# EAGLE design Adafruit PowerBoost Shield (EAGLE 6.6.0)
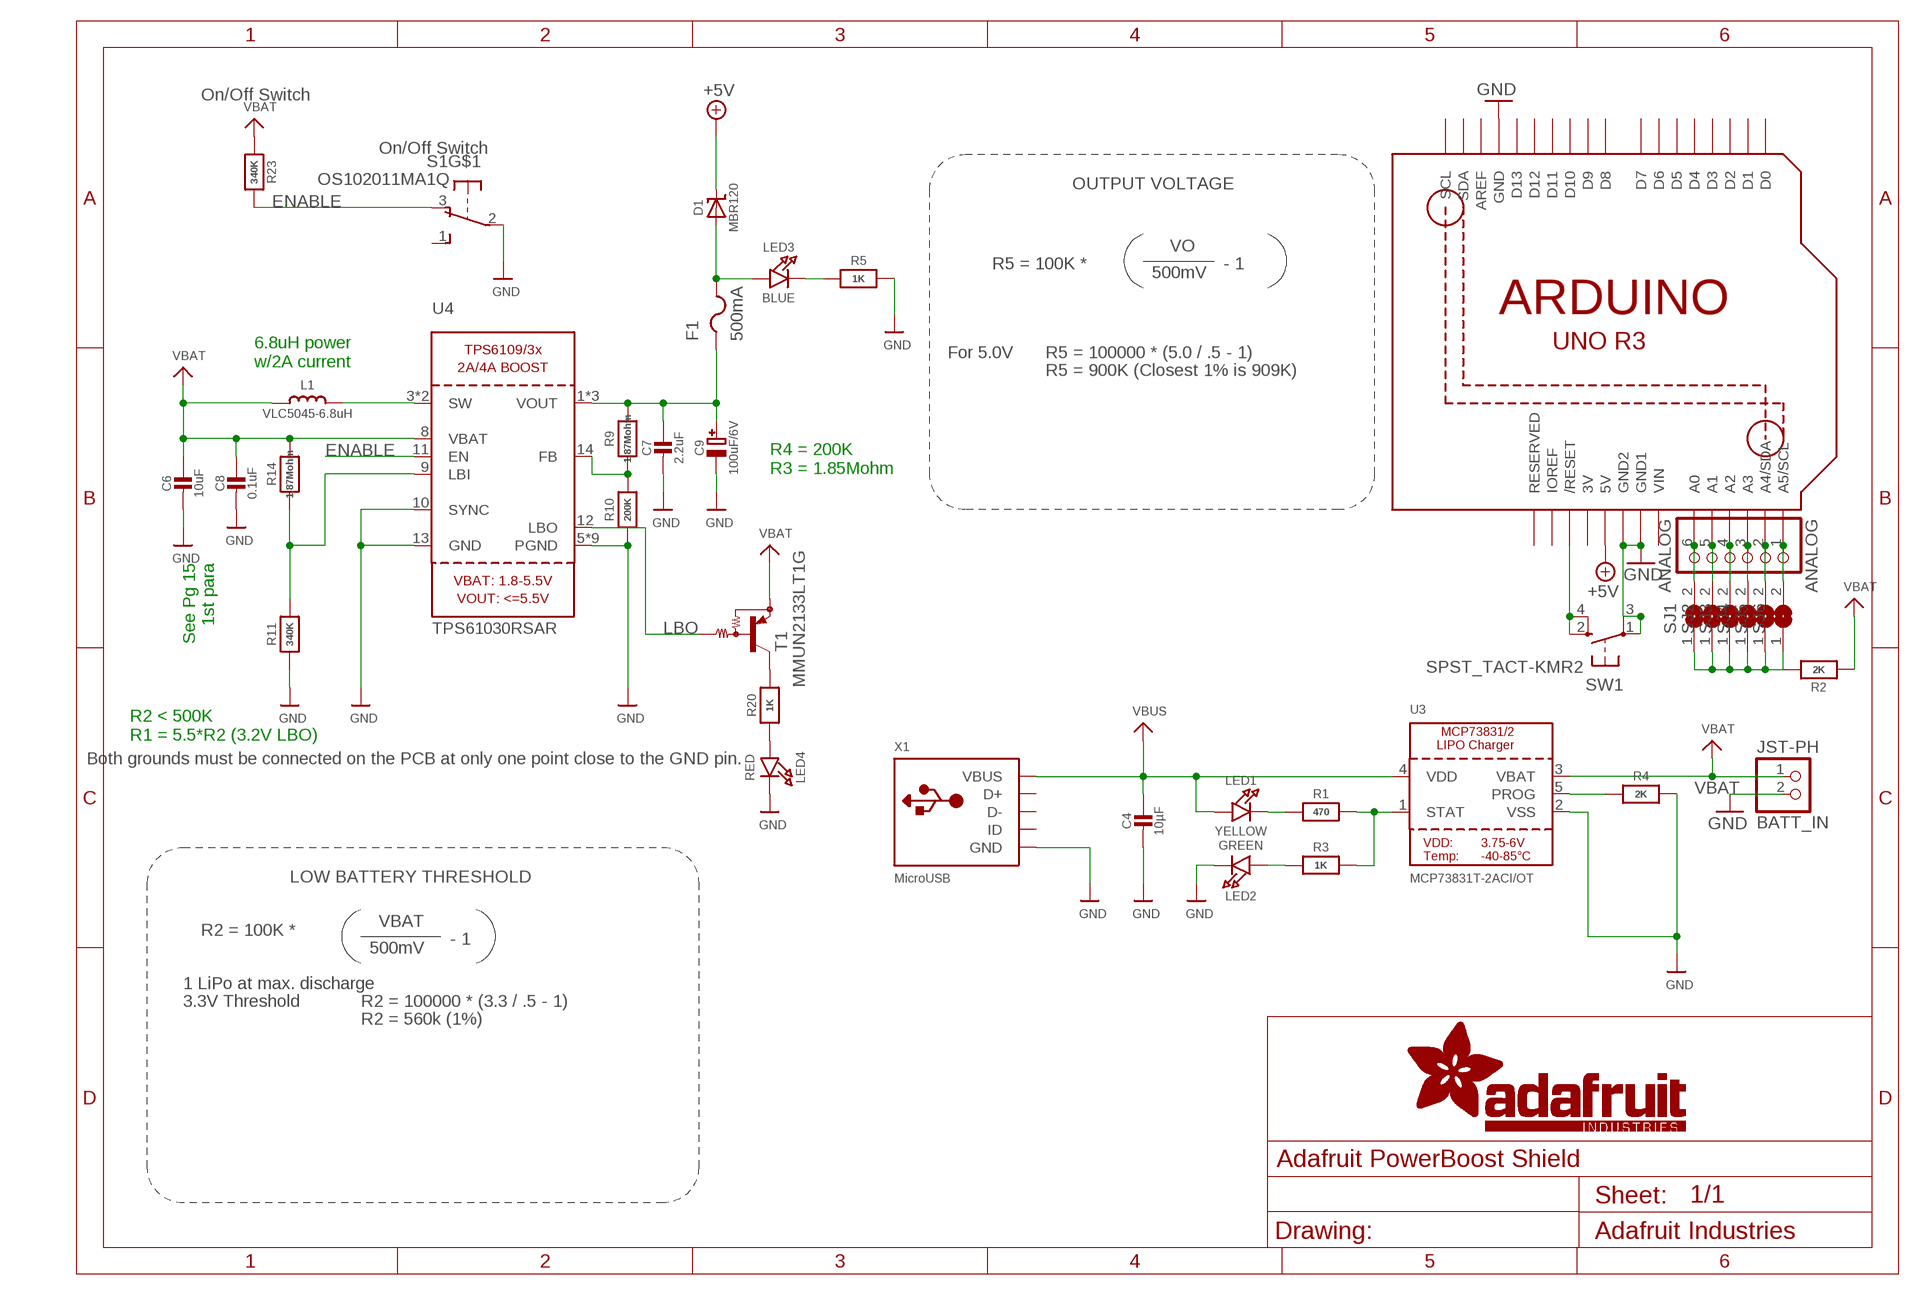
[diagram p0: schematic, sheet 1]

## Parts
ANALOG  ANALOG  PINHD-1X6  [1X06]
BATT_IN  JST-PH  JST_2PIN-SMT  [JST-PH-2-SMT]
C4  10µF  CAP_CERAMIC0805-NOOUTLINE  [0805-NO]
C6  10uF  CAP_CERAMIC0805-NOOUTLINE  [0805-NO]
C7  2.2uF  CAP_CERAMIC0805-NOOUTLINE  [0805-NO]
C8  0.1uF  CAP_CERAMIC0805-NOOUTLINE  [0805-NO]
C9  100uF/6V  CAP_TANTALUMB/3528_REFLOW  [EIA3528-21/B-R]
D1  MBR120  DIODE-SCHOTTKYSOD-123  [SOD-123]
F1  500mA  PTCFUSE-1206  [R1206]
L1  VLC5045-6.8uH  INDUCTORTDK_VLC5045  [INDUCTOR_5X5MM_TDK_VLC5045]
LED1  YELLOW  LED0805_NOOUTLINE  [CHIPLED_0805_NOOUTLINE]
LED2  GREEN  LED0805_NOOUTLINE  [CHIPLED_0805_NOOUTLINE]
LED3  BLUE  LED0805_NOOUTLINE  [CHIPLED_0805_NOOUTLINE]
LED4  RED  LED0805_NOOUTLINE  [CHIPLED_0805_NOOUTLINE]
R1  470  RESISTOR0805_NOOUTLINE  [0805-NO]
R2  2K  RESISTOR0805_NOOUTLINE  [0805-NO]
R3  1K  RESISTOR0805_NOOUTLINE  [0805-NO]
R4  2K  RESISTOR0805_NOOUTLINE  [0805-NO]
R5  1K  RESISTOR0805_NOOUTLINE  [0805-NO]
R9  1.87Mohm  RESISTOR0805_NOOUTLINE  [0805-NO]
R10  200K  RESISTOR0805_NOOUTLINE  [0805-NO]
R11  340K  RESISTOR0805_NOOUTLINE  [0805-NO]
R14  1.87Mohm  RESISTOR0805_NOOUTLINE  [0805-NO]
R20  1K  RESISTOR0805_NOOUTLINE  [0805-NO]
R23  340K  RESISTOR0805_NOOUTLINE  [0805-NO]
S1  OS102011MA1Q  [OS102011MA1Q]
SJ1  SOLDERJUMPER  [SOLDERJUMPER_ARROW_NOPASTE]
SJ2  SOLDERJUMPER  [SOLDERJUMPER_ARROW_NOPASTE]
SJ3  SOLDERJUMPER  [SOLDERJUMPER_ARROW_NOPASTE]
SJ4  SOLDERJUMPER  [SOLDERJUMPER_ARROW_NOPASTE]
SJ5  SOLDERJUMPER  [SOLDERJUMPER_ARROW_NOPASTE]
SJ6  SOLDERJUMPER  [SOLDERJUMPER_ARROW_NOPASTE]
SW1  SPST_TACT-KMR2  [KMR2]
T1  MMUN2133LT1G  MUN2114T1-PNP_DRIVER-SC59-BEC  [SC59-BEC]
U2  ARDUINOR3-NOSILK  [ARDUINOR3-NOSILK]
U3  MCP73831T-2ACI/OT  MCP73831/2  [SOT23-5]
U4  TPS61030RSAR  VREG_TPS6103X  [PVQFN-16]
U$3  FIDUCIAL  [FIDUCIAL_1MM]
U$4  FIDUCIAL  [FIDUCIAL_1MM]
X1  MicroUSB  USBMICRO_20329  [4UCONN_20329]

## Nets
+5V: D1.C U2.5V
A0: ANALOG.6 SJ1.2 U2.A0
A1: ANALOG.5 SJ2.2 U2.A1
A2: ANALOG.4 SJ3.2 U2.A2
A3: ANALOG.3 SJ4.2 U2.A3
A4: ANALOG.2 SJ5.2 U2.A4(A4/SDA)
A5: ANALOG.1 SJ6.2 U2.A5(A5/SCL)
ENABLE: R23.2 S1.3(O) U4.11(EN)
FB: R9.1 R10.2 U4.14(FB)
GND: BATT_IN.2 C4.2 C6.2 C7.2 C8.2 C9.- LED2.C LED4.C R4.2 R5.2 R10.1 R11.1 S1.2(P) SW1.1(P) SW1.3(P1) U2.GND U2.GND1 U2.GND2 U3.2(VSS) U4.5(PGND) U4.6(PGND) U4.7(PGND) U4.10(SYNC) U4.13(GND) U4.P$18(PGND) U4.P$19(PGND) U4.P$20(PGND) U4.P$21(PGND) U4.P$22(PGND) U4.THERMAL(PGND) X1.BASE@1(GND) X1.BASE@2(GND) X1.GND X1.SPRT@1(GND) X1.SPRT@2(GND) X1.SPRT@3(GND) X1.SPRT@4(GND)
LBI: R11.2 R14.1 U4.9(LBI)
LBO: T1.B U4.12(LBO)
N$1: R2.2 SJ1.1 SJ2.1 SJ3.1 SJ4.1 SJ5.1 SJ6.1
N$2: LED1.C R1.1
N$3: R1.2 R3.2 U3.1(STAT)
N$4: L1.P$2 U4.3(SW) U4.4(SW)
N$5: R4.1 U3.5(PROG)
N$6: LED2.A R3.1
N$9: LED3.C R5.1
N$15: LED4.A R20.1
N$16: R20.2 T1.C
N$19: D1.A F1.2 LED3.A
RESET: SW1.2(S) SW1.4(S1) U2.RESET(/RESET)
VBAT: BATT_IN.1 C6.1 C8.1 L1.P$1 R2.1 R14.2 R23.1 T1.E U3.3(VBAT) U4.8(VBAT)
VBUS: C4.1 LED1.A U3.4(VDD) X1.VBUS
VOUT: C7.1 C9.+ F1.1 R9.2 U4.1(VOUT) U4.15(VOUT) U4.16(VOUT)
Unconnected: S1.1(S) S1.MT1(MT) S1.MT2(MT) U2.AREF U2.D0 U2.D1 U2.D2 U2.D3 U2.D4 U2.D5 U2.D6 U2.D7 U2.D8 U2.D9 U2.D10 U2.D11 U2.D12 U2.D13 U2.IOREF U2.RESERVED U2.SCL U2.SDA X1.D+ X1.D- X1.ID

## Notes on the sheet
- On/Off Switch
- On/Off Switch
- OUTPUT VOLTAGE
- VO
- R5 = 100K * | - 1
- 500mV
- For 5.0V | R5 = 100000 * (5.0 / .5 - 1)
- 6.8uH power
  w/2A current
- R5 = 900K (Closest 1% is 909K)
- R4 = 200K
  R3 = 1.85Mohm
- See Pg 15
  1st para
- R2 < 500K
  R1 = 5.5*R2 (3.2V LBO)
- Both grounds must be connected on the PCB at only one point close to the GND pin.
- LOW BATTERY THRESHOLD
- VBAT
- R2 = 100K *
- - 1
- 500mV
- 1 LiPo at max. discharge
- 3.3V Threshold | R2 = 100000 * (3.3 / .5 - 1)
- R2 = 560k (1%)

## Power pins joined to a net without a drawn wire
3V: U2.3V
VIN: U2.VIN

## Library data of the parts
ANALOG = adafruit:PINHD-1X6: PIN HEADER
BATT_IN = adafruit:JST_2PIN: JST 2-Pin Connectors of various flavors SMT-RA (S2B-PH-SM4) 4UConnector #17311 SMT (B2B-PH-SM4) THM-RA (S2B-PH) THM (B2B-PH)
C4 C6-C8 = microbuilder:CAP_CERAMIC: Ceramic Capacitors For new designs, use the packages preceded by an '_' character since they are more reliable: The following footprints should be used on most boards: _0402 - Standard footprint for regular board layouts _0603 - Standard footprint for regular board layouts _0805 - Standard footprint for regular board layouts _1206 - Standard footprint for regular board layouts For extremely tight-pitch boards where space is at a premium, the following 'micro-pitch' footprints can be used (smaller pads, no silkscreen outline, etc.): _0402MP - Micro-pitch footprint for very dense/compact boards _0603MP - Micro-pitch footprint for very dense/compact boards _0805MP - Micro-pitch footprint for very dense/compact boards _1206MP - Micro-pitch footprint for very dense/compact boards
C9 = microbuilder:CAP_TANTALUM: Tantalum Capacitors Wave footprints have larger pads and are meant to be used for hand soldering. Reflow footprints are optimised for solder paste and a reflow oven. EIA3216-18/A-[R/W] - Size A / 3216-18 / 1206 footprint 4.7µF 25V 10% Tantalum Capacitor 10µF 16V 10% Tantalum Capacitor [Digikey: 495-2236-2-ND] EIA3528-21/B-[R/W] - Size B / 3528-21 47µF 10V 10% Tantalum Capactior [Digikey: 495-2216-1-ND] EIA6032-28/C-[R/W] - Size C / 6032-28 10µF 35V 20% Tantalum Capacitor [Digikey: 495-2285-1-ND] 100µF 16V 10% Tantalum Capactior [Digikey: 399-5214-1-ND]
D1 = microbuilder:DIODE-SCHOTTKY
F1 = adafruit:PTCFUSE: PTC fuses, resettable thermistors
L1 = microbuilder:INDUCTOR: Inductors 0603: 10nH Ceramic Inductor - microwire antenna/RF (Digikey: 712-1434-2-ND) 0805: 560nH Ceramic Inductor - RF (Digikey: 553-1047-1-ND) 270nH Ceramic Inductor - Q = 40@250MHz, +-5%, 1 Ohm DC Resistance (Digikey: 535-10506-2-ND) 1007 (2518 Metric) SMT: 10µH 10% 250mOhm 820mA 1007 Inductor (Digikey: 587-2189-1-ND) 22µH 10% 500mOhm 580mA 1007 Inductor (Digikey: 587-2190-1-ND) 47µH 10% 950mOhm 420mA 1007 Inductor (Digikey: 587-2191-1-ND) 47µH 5% 100mOhm 1A 1008 Inductor (Digikey: 732-1816-1-ND) 5.0x5.0mm (Taiyo Yuden NR5040 Series) 6.8µH 20% 2.3A 64mOhm Inductor (Digikey: 587-2374-2-ND) 5.0x5.0mm (TDK VLC5045 Series) 4.7µH 20% 3.3A 34mOhm Inductor (Digikey: 445-6526-1-ND) 6.8µH 20% 2.7A 46mOhm Inductor (Digikey: 445-6527-1-ND) 6.0x6.0mm (TDK VLC6045 Series) 4.7µH 20% 3.8A 27mOhm Inductor (Digikey: 445-6538-2-ND) 6.8µH 20% 3A 41mOhm Inductor (Digikey: 445-6540-1-ND) 6.2µH 30% 2.2A 45mOhm Inductor (Digikey: SRR5028-6R2YCT-ND) - Not TDK VLC6045 but footprint should match 6.0x6.0mm (TDK SLF6045 Series) 6.8uH 30% 2A 33mOhm Inductor (Digikey: 445-4572-1-ND, Mouser: 810-SLF645T6R8N2R0PF) 6.0x6.0mm (Sumida CDRH5D28 Series) 6.2uH 30% 1.8A 45mOhm Inductor (Digikey: 308-1542-1-ND) Taiyo Yuden NR3015T2R2M - 2.2uH 20% 1.5A (Digikey: 587-1648-2-ND, Mouser: 963-NR3015T2R2M) - Used with TI TPS62172 CoilCraft RFID Transponder Coil - MA5532-AE (For use with AS3935 Lightning Sensor) Vishay IHLP 1.0uH Molded Inductor - 24mOhm DCR, 5A, +/-20%, -55°C-125°C (Digikey: 541-1319-1-ND)
LED1-LED4 = microbuilder:LED: LED 0603 - 0603 Surface Mount Package 2mA: Green LED - Low Power (3.9mcd, 2ma, 1.7Vf) - Digikey: 475-2709-2-ND Orange LED - Low Power (9.8mcd, 2ma, 1.8Vf) - Digikey: 475-1194-2-ND Red LED - Low Power (5mcd, 2ma, 1.8Vf) - Digikey: 475-1195-2-ND Yellow LED - Low Power (7mcd, 2ma, 1.8Vf) - Digikey: 475-1196-2-ND 5mA: Blue LED - Low Power (17mcd, 5ma, 2.9Vf) - Digikey: LNJ937W8CRACT-ND 0805 - 0805 Surface Mount Package 2mA: Red LED (8.8mcd, 2mA, 1.8Vf, Clear) - Low Power [Digikey: 475-2510-1-ND] Green LED (5mcd, 2mA, 1.8Vf, Clear) - Low Power [Digikey: 475-2730-1-ND] Yellow LED (11.3mcd, 2mA, 1.8Vf, Clear) - Low Power [Digikey: 475-2555-1-ND] 20mA: Red LED (104mcd, 20mA, Diffused) - LS R976 [Digikey: 475-1278-6-ND] Red LED (12mcd, 20mA, 2.0Vf, Clear) - APT2012EC [Digikey: 754-1128-1-ND] Green LED (15mcd, 20mA, 2.2Vf, Clear) - APT2012GC [Digikey: 754-1131-1-ND] Orange LED (160mcd, 20mA, 2.1Vf, Clear) - APT2012SECK [Digikey: 754-1130-1-ND] 1206 - 1206 Surface Mount Package Green LED (26mcd, 20mA, Diffused) - LG N971 [Digikey: 475-1407-6-ND] Red LED (15mcd, 20mA, Diffused) - LH N974 [Digikey: 475-1416-6-ND] Cree - Cree High-Power Surface Mount LEDs XPEBWT-L1-0000-00D50 - White 111lm 350mA 2.9Vf 6200K 110° XTEAWT-00-0000-00000LEE3 - White 114lm 350mA 2.85Vf 5000K 115° Everlight - Everlight 45-21 Series Surface Mount LEDs 45-21/QK2C-B2832AC2CB2/2T - Warm White 2000mcd 20mA 3.25Vf 3050K 120° 45-21/LK2C-B38452C4CB2/2T - Nuetral White 2000mcd 20mA 3.25Vf 4150K 120° 45-21/LK2C-B50634C6CB2/2T - Cold White 2200mcd 20mA 3.25Vf 5650K 120° PLCC2 Reverse Mount LS T77K-J1L2-1-0-2-R18-Z - Red 11.25mcd 2mA 1.8Vf 630nm 120° LO T77K-L1M2-24-Z - Orange 19.6mcd 2mA 1.8Vf 606nm 120° LY T77K-K2M1-26-Z - Yellow 15.7mcd 2mA 1.8Vf 587nm 120°
R1-R5 R9-R11 R14 R20 R23 = microbuilder:RESISTOR: Resistors For new designs, use the packages preceded by an '_' character since they are more reliable: The following footprints should be used on most boards: _0402 - Standard footprint for regular board layouts _0603 - Standard footprint for regular board layouts _0805 - Standard footprint for regular board layouts _1206 - Standard footprint for regular board layouts For extremely tight-pitch boards where space is at a premium, the following 'micro-pitch' footprints can be used (smaller pads, no silkscreen outline, etc.): _0402MP - Micro-pitch footprint for very dense/compact boards _0603MP - Micro-pitch footprint for very dense/compact boards _0805MP - Micro-pitch footprint for very dense/compact boards _1206MP - Micro-pitch footprint for very dense/compact boards
S1 = adafruit:OS102011MA1Q: OS10201MA1Q through-hole right angle switch http://www.ladyada.net/library/eagle
SJ1-SJ6 = microbuilder:SOLDERJUMPER: SMD Solder JUMPER Solder the two pads together to create a connection, or remove the solder to break it. REFLOW - Use this footprint for solder paste and reflow ovens. WAVE - Use this footprint for hand-soldering (larger pads). CLOSED - Has a trace between the two pads to ensure it is closed by default. The trace needs to be cut to disable the jumper, and can be closed again by creating a solder bridge between the two pads.; BOM: EXCLUDE
SW1 = adafruit:SPST_TACT: SMT 6mm switch, EVQQ2 series http://www.ladyada.net/library/eagle
T1 = transistor:*-PNP_DRIVER-: PNP Bias Resistor Transistor
U2 = microbuilder:ARDUINOR3: This is a new object for the new Arduino R3 - with extra pins that you may want to use (such as IOref, and duplicated A4/A5
U3 = microbuilder:MCP73831/2: MCP73831/2 LIPO Charger VDD: 3.75 - 6V Temp -40 - 85°C Programmable Charge Rate: 15-500mA NOTE: STAT is a tri-state logic output on the MCP73831 and an open-drain output on the MCP73832. SOT23-5 with 4.2V output and tri-state logic on STAT = MCP73831T-2ACI/OT
U4 = microbuilder:VREG_TPS6103X: TPS6103x 4A Boost - 1.8-5.5V Input, Adjustable Output to 5.5V
U$3 U$4 = adafruit:FIDUCIAL: For use by pick and place machines to calibrate the vision/machine, 1mm By microbuilder.eu
X1 = microbuilder:USB: USB Connectors USBMINIB - Surface Mount Female Mini-B USB Connector 4UConnector: 06564

## Board
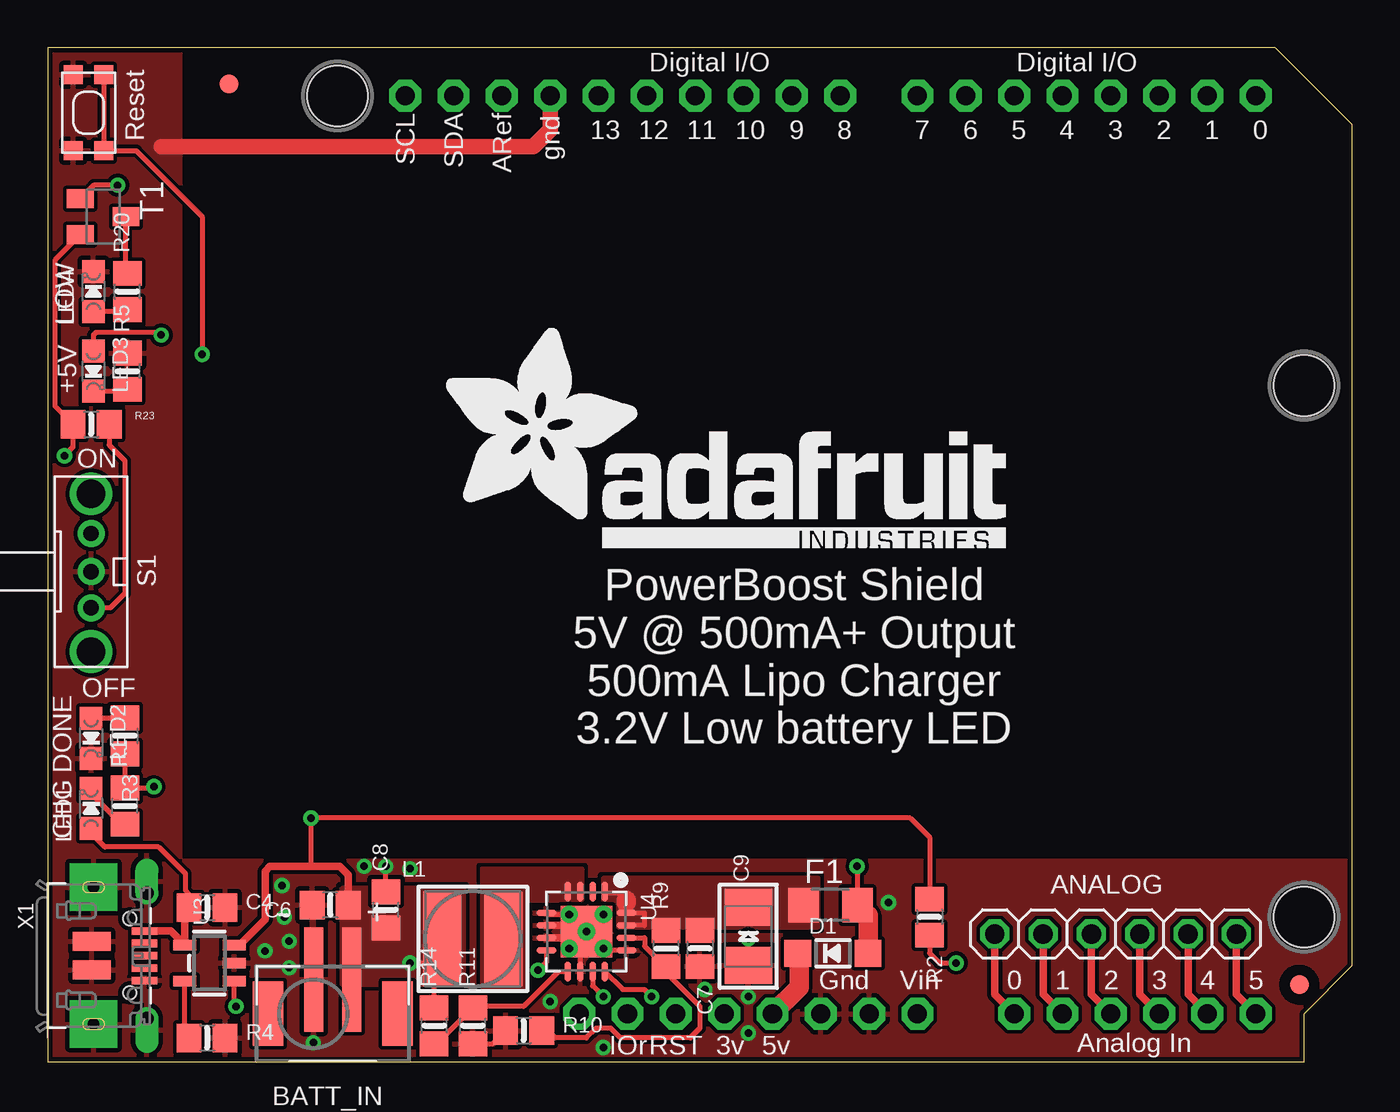
[diagram p1: board, top side]
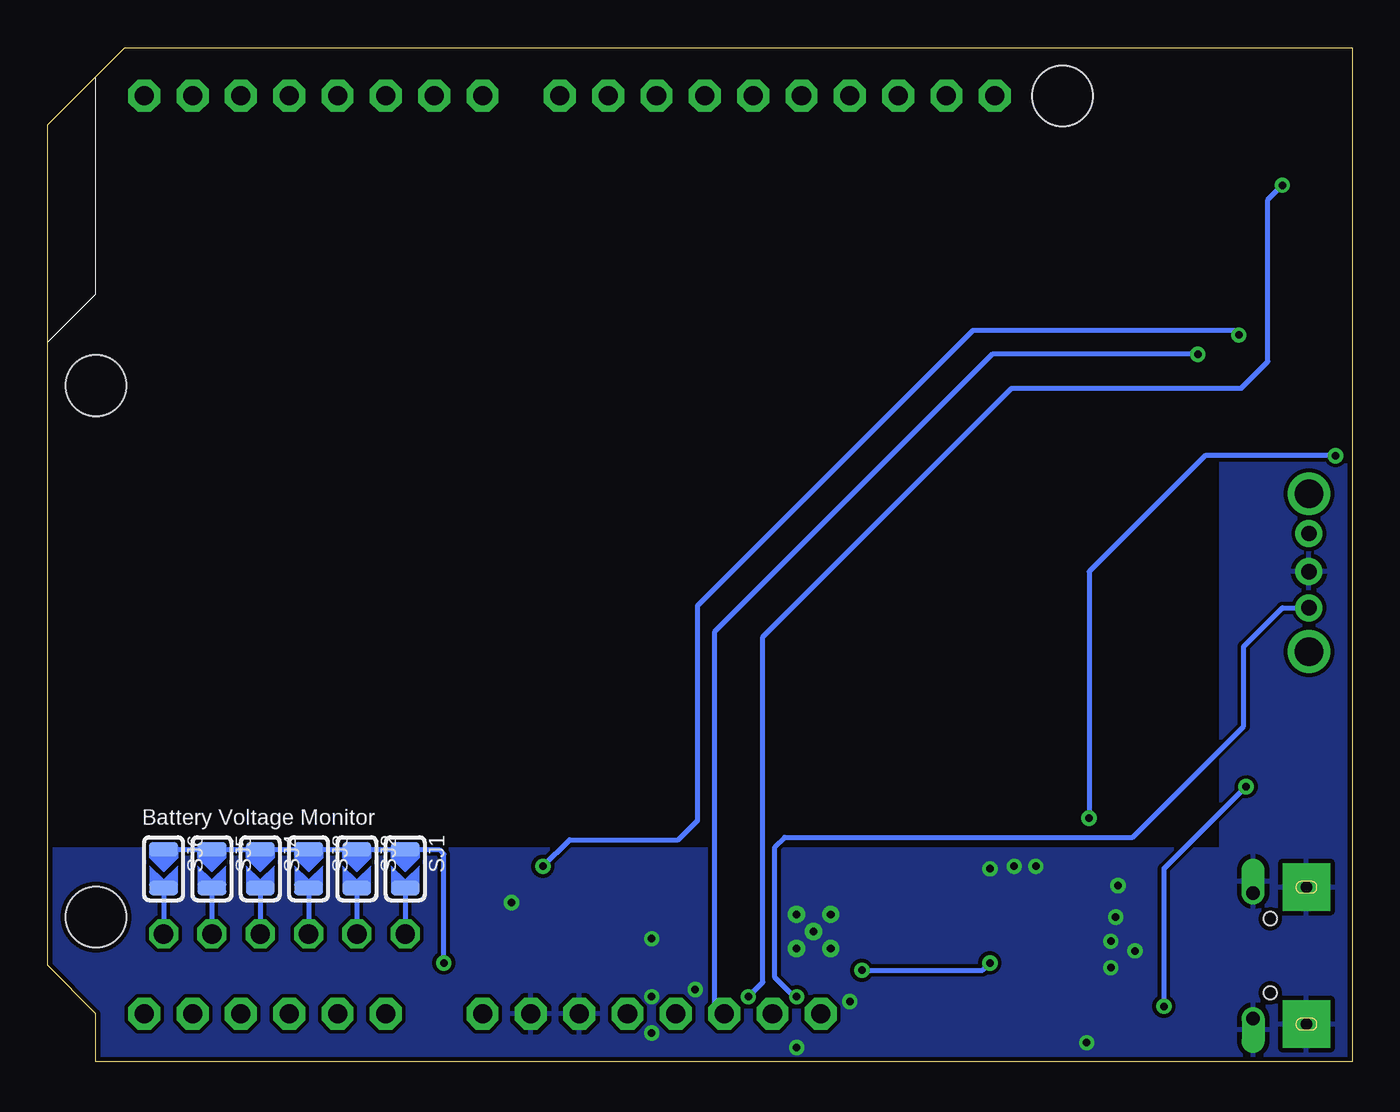
[diagram p2: board, bottom side, seen from below]

Size 68.58 x 53.34 mm. Coordinates in mm from the lower left corner, seen from the top.
Outline: 0,0 66.04,0 66.04,2.54 68.58,5.08 68.58,49.28 64.52,53.34 0,53.34 0,0
Copper layers (1*16): Top 0.035mm / dielectric 1.5mm / Bottom 0.035mm
Design rules "adafruit *": minimum track width 8mil, minimum drill 15.5mil, track to track 8mil, track to pad 8mil, pad to pad 8mil, via to via 8mil, smd to smd 8mil, copper to edge 10mil, drill to drill 8mil, minimum pad ring 10mil, minimum via ring 8mil, stop-mask expansion 2mil, vias tented up to drill 20mil, thermal gap 10mil
Holes 3.2 mm at 15.24,50.8 66.04,7.62 66.04,35.56
tRestrict: area 26,7.5 to 26.4,7.6; area 25.9,6.8 to 26.3,6.9

### Footprints (pad centres in the part's own frame; a part is rotated, then mirrored left to right if it is on the bottom)
1X06 = drill 1.016 octagon: 1 -6.35,0; 2 -3.81,0; 3 -1.27,0; 4 1.27,0; 5 3.81,0; 6 6.35,0
JST-PH-2-SMT = smd 1 x 5.5: 1 -1,-1.8; 2 1,-1.8 | smd 1.6 x 3.4: NC1 -3.4,0; NC2 3.4,0
0805-NO = smd 1.3 x 1.5: 1 -0.95,0; 2 0.95,0
EIA3528-21/B-R = smd 1.95 x 2.5: + 1.525,0; - -1.525,0
SOD-123 = smd 1.4 x 1.4: A 1.85,0; C -1.85,0
R1206 = smd 1.6 x 1.803: 1 -1.422,0; 2 1.422,0
INDUCTOR_5X5MM_TDK_VLC5045 = smd 2 x 5: P$1 -1.6,0; P$2 1.6,0
CHIPLED_0805_NOOUTLINE = smd 1.2 x 1.2: A 0,-1.05; C 0,1.05
OS102011MA1Q = drill 0.8 pad 1.422: 1 -2,0; 2 0,0; 3 1.9,0 | drill 1.5 pad 2.184: MT1 -4.1,0; MT2 4.2,0
SOLDERJUMPER_ARROW_NOPASTE = smd 0.762 x 1.524: 1 -1.016,0; 2 1.016,0
KMR2 = smd 1 x 1: 1 2,0.8; 2 2,-0.8; 3 -2,0.8; 4 -2,-0.8
SC59-BEC = smd 1 x 1.4: B -0.95,-1.2; C 0,1.2; E 0.95,-1.2
ARDUINOR3-NOSILK = drill 1 pad 1.676 octagon: 3V 35.56,2.54; 5V 38.1,2.54; A0 50.8,2.54; A1 53.34,2.54; A2 55.88,2.54; A3 58.42,2.54; A4 60.96,2.54; A5 63.5,2.54; AREF 23.876,50.8; D0 63.5,50.8; D1 60.96,50.8; D2 58.42,50.8; D3 55.88,50.8; D4 53.34,50.8; D5 50.8,50.8; D6 48.26,50.8; D7 45.72,50.8; D8 41.656,50.8; D9 39.116,50.8; D10 36.576,50.8; D11 34.036,50.8; D12 31.496,50.8; D13 28.956,50.8; GND 26.416,50.8; GND1 43.18,2.54; GND2 40.64,2.54; IOREF 30.48,2.54; RESERVED 27.94,2.54; RESET 33.02,2.54; SCL 18.796,50.8; SDA 21.336,50.8; VIN 45.72,2.54
SOT23-5 = smd 0.55 x 1.2: 1 -0.95,-1.3; 2 0,-1.3; 3 0.95,-1.3; 4 0.95,1.3; 5 -0.95,1.3
PVQFN-16 = smd 1.05 x 0.35: 1 -2.1,0.975; 2 -2.1,0.325; 3 -2.1,-0.325; 4 -2.1,-0.975; 9 2.1,-0.975; 10 2.1,-0.325; 11 2.1,0.325; 12 2.1,0.975 | smd 0.35 x 1.05: 5 -0.975,-2.1; 6 -0.325,-2.1; 7 0.325,-2.1; 8 0.975,-2.1; 13 0.975,2.1; 14 0.325,2.1; 15 -0.325,2.1; 16 -0.975,2.1 | drill 0.4: P$18 0,0; P$19 -0.9,0.9; P$20 0.9,0.9; P$21 0.9,-0.9; P$22 -0.9,-0.9 | smd 2.7 x 2.7: THERMAL 0,0
FIDUCIAL_1MM = smd 1 x 1: 1 0,0
4UCONN_20329 = smd 1 x 2: BASE@1 -0.75,-2; BASE@2 0.75,-2 | smd 0.4 x 1.35: D+ 0,0.775; D- -0.65,0.775; GND 1.3,0.775; ID 0.65,0.775; VBUS -1.3,0.775 | drill 0.7 offset: SPRT@1 -3.3,0.9; SPRT@2 3.3,0.9 | drill 0.6 pad 2.5 square: SPRT@3 -3.6,-1.9; SPRT@4 3.6,-1.9 | hole 0.7: -1.95,0; 1.95,0

### Placement (x,y rotation side)
ANALOG  56.13,6.73 180 top
BATT_IN  14.99,2.54 180 top
C4  8.38,8.13 0 top
C6  14.86,8.26 180 top
C7  34.29,5.97 270 top
C8  17.78,8 90 top
C9  36.83,6.6 90 top
D1  41.27,5.71 0 top
F1  41.15,8.26 0 top
L1  22.35,6.48 0 top
LED1  2.29,13.34 0 top
LED2  2.29,17.02 180 top
LED3  2.41,36.32 180 top
LED4  2.41,40.51 0 top
R1  4.06,13.46 90 top
R2  46.35,7.62 270 top
R3  4.06,17.14 270 top
R4  8.38,1.27 0 top
R5  4.19,36.32 90 top
R9  32.51,5.97 90 top
R10  25.02,1.65 0 top
R11  22.35,1.91 90 top
R14  20.32,1.91 90 top
R20  4.19,40.51 90 top
R23  2.29,33.53 0 top
S1  2.29,25.78 270 top
SJ1  49.78,10.16 270 bottom
SJ2  52.32,10.16 270 bottom
SJ3  54.86,10.16 270 bottom
SJ4  57.4,10.16 270 bottom
SJ5  59.94,10.16 270 bottom
SJ6  62.48,10.16 270 bottom
SW1  2.16,49.91 90 top
T1  2.92,44.45 270 top
U2  0,0 0 top
U3  8.51,5.21 90 top
U4  28.32,6.86 270 top
U$3  9.53,51.44 90 top
U$4  65.79,4.06 90 top
U$6  [ADAFRUIT_TEXT_30MM]  20.7,27.05 0 top
X1  4.32,5.59 270 top

### Tracks (layer width: path | path; a pad name or v marks a point on that pad's centre or on a via)
+5V
  Top 0.254: 39.5,5.74 39.47,5.71 D1.C
  Top 1.016: U2.5V 39.5,3.94 39.5,5.74
A0
  Top 0.406: ANALOG.6 49.78,3.56 U2.A0
  Bottom 0.254: SJ1.2 ANALOG.6
A1
  Top 0.406: ANALOG.5 52.32,3.56 U2.A1
  Bottom 0.254: SJ2.2 ANALOG.5
A2
  Top 0.406: ANALOG.4 54.86,3.56 U2.A2
  Bottom 0.254: SJ3.2 ANALOG.4
A3
  Top 0.406: ANALOG.3 57.4,3.56 U2.A3
  Bottom 0.254: SJ4.2 ANALOG.3
A4
  Top 0.406: ANALOG.2 59.94,3.56 U2.A4
  Bottom 0.254: SJ5.2 ANALOG.2
A5
  Top 0.406: ANALOG.1 62.48,3.56 U2.A5
  Bottom 0.254: SJ6.2 ANALOG.1
ENABLE  (via drill 0.39)
  Top 0.254: R23.2 3.24,32.45 4.06,31.62 4.06,24.64 3.3,23.88 S1.3 | U4.11 28.65,3.99 v29.21,3.43
  Bottom 0.254: v29.21,3.43 29.34,3.43 30.35,4.45 30.35,11.3 29.84,11.81 11.56,11.81 5.71,17.65 5.71,21.84 3.68,23.88 S1.3
FB
  Top 0.254: U4.14 31.38,6.53 31.38,6.09 32.51,4.95 R9.1 32.51,4.7 34.29,2.92 34.29,1.78 33.78,1.27 30.1,1.27 29.59,1.78 28.83,1.78 28.32,1.27 26.67,1.27 26.16,1.78 26.1,1.78 R10.2
GND  (via drill 0.39)
  Top 0.254: U4.5 26.3,7.76 U4.P$22 27.43,7.75 | U4.10 28,5.71 27.94,5.71 27.57,6.08 27.57,5.96 U4.P$21 | U4.13 29.22,5.88 U4.P$20 | C8.2 v17.78,10.29 | U4.THERMAL 28.19,6.86 | R11.1 23.37,0.95 R10.1
  Top 0.406: U4.6 27.43,7.18 27.43,7.75 | U4.7 28.19,6.53 28.19,6.86
  Top 0.813: U2.GND 26.42,49.02 25.53,48.13 5.97,48.13
  other vias: 29.21,0.76 12.45,7.62 12.7,4.95 13.97,1.02 11.43,5.84 12.32,9.27 16.64,10.29 19.05,10.16 26.42,3.17 12.7,6.35 36.83,1.52 36.83,3.43 34.54,3.81 44.2,8.38 36.83,6.48
  pour Bottom: 68.45,0.13 68.45,11.18 6.86,11.18 6.86,53.47 0,53.59 0,0.13
  pour Top (rank 5): 68.45,-0.38 68.45,10.54 6.99,10.54 6.99,53.59 0.13,53.59 -0.25,-0.38
LBI
  Top 0.254: R14.1 20.45,0.95 R11.2 22.42,2.92 25.02,2.92 26.86,4.76 U4.9
LBO  (via drill 0.39)
  Top 0.254: 29.36,4.7 U4.12 29.3,4.74 30.23,3.81 31.37,3.81 v31.75,3.43 | v3.68,46.1 2.42,46.1 T1.B
  Bottom 0.254: v31.75,3.43 30.99,4.19 30.99,22.35 17.91,35.43 5.84,35.43 4.45,36.83 4.45,45.34 v3.68,46.1
N$1  (via drill 0.39)
  Top 0.254: R2.2 46.35,5.71 46.86,5.21 v47.75,5.21
  Bottom 0.254: SJ6.1 SJ5.1 SJ4.1 SJ3.1 SJ2.1 SJ1.1 48.01,11.18 47.75,10.92 v47.75,5.21
N$2
  Top 0.254: LED1.C 2.29,14.1 3.56,12.83 3.75,12.83 R1.1
N$3  (via drill 0.39)
  Top 0.254: R3.2 R1.2 5.52,14.41 v5.59,14.48 | v9.91,2.92 9.81,3.02 U3.1
  Bottom 0.254: v9.91,2.92 9.91,10.16 v5.59,14.48
N$4
  Top 0.254: 28,9.02 U4.3 | U4.4 27.35,9.14
  pour Top (no thermals): 22.86,4.83 22.86,10.16 28.07,10.16 28.07,8.51 25.15,8.51 25.15,3.94 22.86,3.94
N$5
  Top 0.254: R4.1 7.21,1.05 U3.5
N$6
  Top 0.254: LED2.A 2.31,18.09 R3.1
N$9
  Top 0.254: LED3.C 4.09,35.27 R5.1
N$15
  Top 0.254: R20.1 4.09,39.46 LED4.A
N$16
  Top 0.254: R20.2 4.12,41.53 T1.C
N$19  (via drill 0.39)
  Top 0.254: F1.2 42.57,10.26 v42.55,10.29 | v5.97,38.23 5.84,38.35 2.54,38.35 2.41,38.23 LED3.A
  Top 1.016: F1.2 43.12,7.7 D1.A
  Bottom 0.254: v42.55,10.29 41.15,11.68 35.43,11.68 34.42,12.7 34.42,24 19.94,38.48 6.22,38.48 v5.97,38.23
RESET  (via drill 0.39)
  Top 0.254: SW1.2 SW1.4 4.67,47.91 8.13,44.45 v8.13,37.21
  Bottom 0.254: v8.13,37.21 18.92,37.21 33.53,22.61 33.53,3.05 U2.RESET
VBAT  (via drill 0.39)
  Top 0.254: U4.8 26.22,5.27 v25.78,4.83 | v19.05,5.21 20.32,5.21 | 20.32,5.21 20.45,5.21 20.7,5.46 | T1.E 0.38,42.16 0.38,34.48 R23.1 1.34,32.32 v0.89,31.88 | 13.84,10.29 v13.84,12.83 45.34,12.83 46.35,11.81 R2.1 | R14.2 20.32,5.21
  Top 0.406: C6.1 15.81,9.85 15.37,10.29 13.84,10.29 11.68,10.29 11.43,10.03 11.43,7.49 10.09,6.16 U3.3
  Bottom 0.254: v25.78,4.83 19.43,4.83 v19.05,5.21 | v0.89,31.88 7.75,31.88 13.84,25.78 v13.84,12.83
  pour Top (rank 2, no thermals): 15.49,4.06 15.49,9.14 21.84,9.14 21.84,4.06
VBUS
  Top 0.254: C4.1 7.43,8.82 7.24,9.02 7.24,9.91 5.84,11.3 3.01,11.3 2.29,12.03 LED1.A
  Top 0.406: X1.VBUS 6.48,6.89 U3.4 7.21,7.91 C4.1
VOUT
  Top 0.254: U4.15 31.37,7.18 31.37,7.83 U4.16 30.42,8.51 30.42,8.89 29.3,8.89 U4.1 | 36.7,8.13 C9.+
  Top 1.016: 30.42,8.38 30.42,8.51
  pour Top (no thermals): 29.21,9.65 29.21,8.51 29.97,8.51 29.97,7.11 40.51,7.11 40.51,9.65

### Text on the board
tPlace: Reset | Digital I/O | Digital I/O | SCL | SDA | ARef | gnd | 13 | 12 | 11 | 10 | 9 | 8 | 7 | 6 | 5 | 4 | 3 | 2 | 1 | 0 | LOW | +5V | ON | PowerBoost Shield / 5V @ 500mA+ Output / 500mA Lipo Charger / 3.2V Low battery LED | DONE | OFF | CHG | Gnd | Vin | 0 | 1 | 2 | 3 | 4 | 5 | IOr | RST | 3v | 5v | Analog In
bPlace: Battery Voltage Monitor